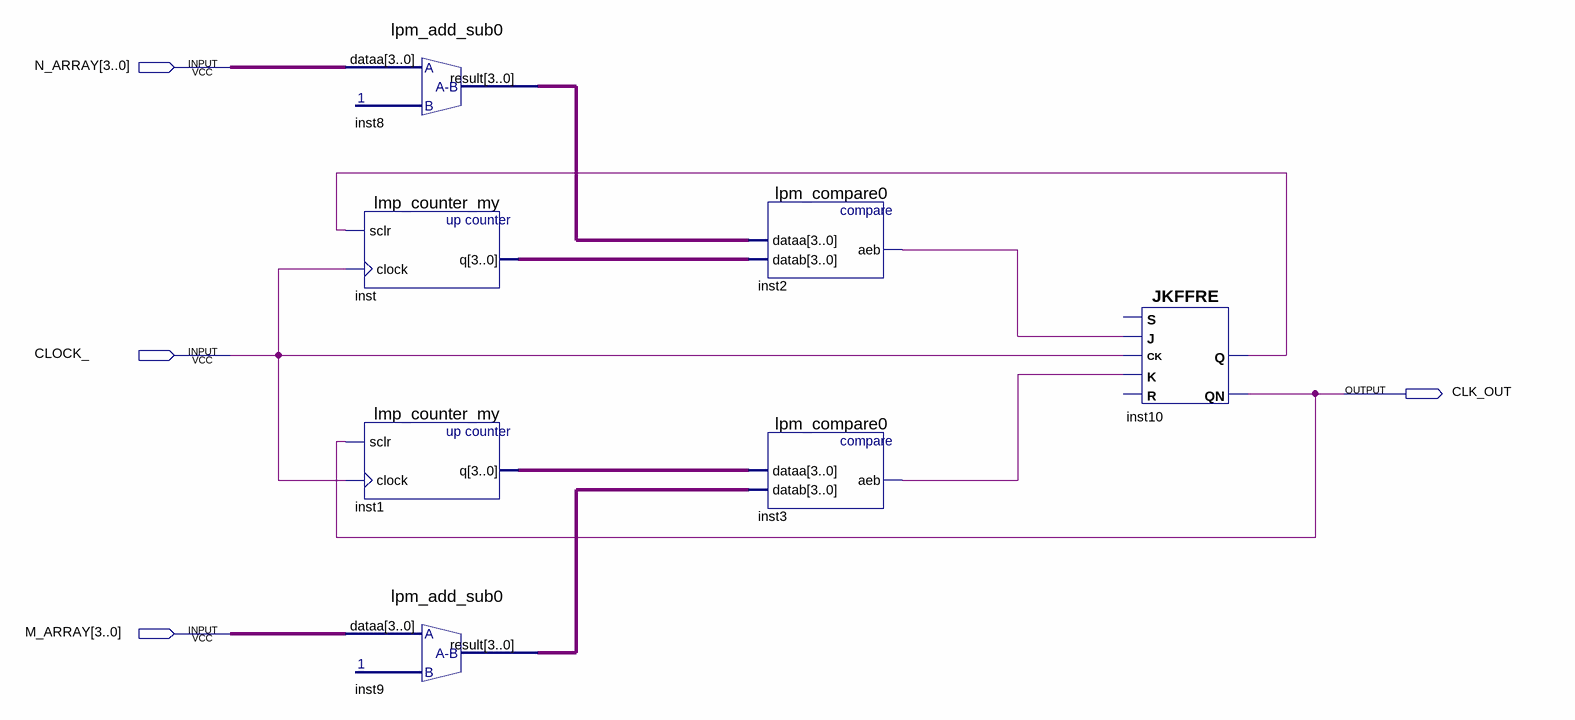
[diagram p0: schematic sheet]
// Quartus schematic Block1.bdf as structural Verilog: 7 symbols, 4 pins
module Block1 (
  input  [3:0] N_ARRAY,
  input  CLOCK_,
  input  [3:0] M_ARRAY,
  output CLK_OUT
);

  wire inst2_aeb, inst3_aeb, inst10_q;
  wire [3:0] inst1_q, inst8_result, inst9_result, inst_q;

  lpm_add_sub0 inst8 (.dataa(N_ARRAY), .result(inst8_result));
  lmp_counter_my inst (.sclr(inst10_q), .clock(CLOCK_), .q(inst_q));
  lmp_counter_my inst1 (.sclr(CLK_OUT), .clock(CLOCK_), .q(inst1_q));
  lpm_add_sub0 inst9 (.dataa(M_ARRAY), .result(inst9_result));
  lpm_compare0 inst2 (.dataa(inst8_result), .datab(inst_q), .aeb(inst2_aeb));
  lpm_compare0 inst3 (.dataa(inst1_q), .datab(inst9_result), .aeb(inst3_aeb));
  JKFFRE inst10 (.K(inst3_aeb), .CK(CLOCK_), .J(inst2_aeb), .QN(CLK_OUT), .Q(inst10_q));  // open: R, S
endmodule
